# Altium schematic sheet MCU.SchDoc
size A4
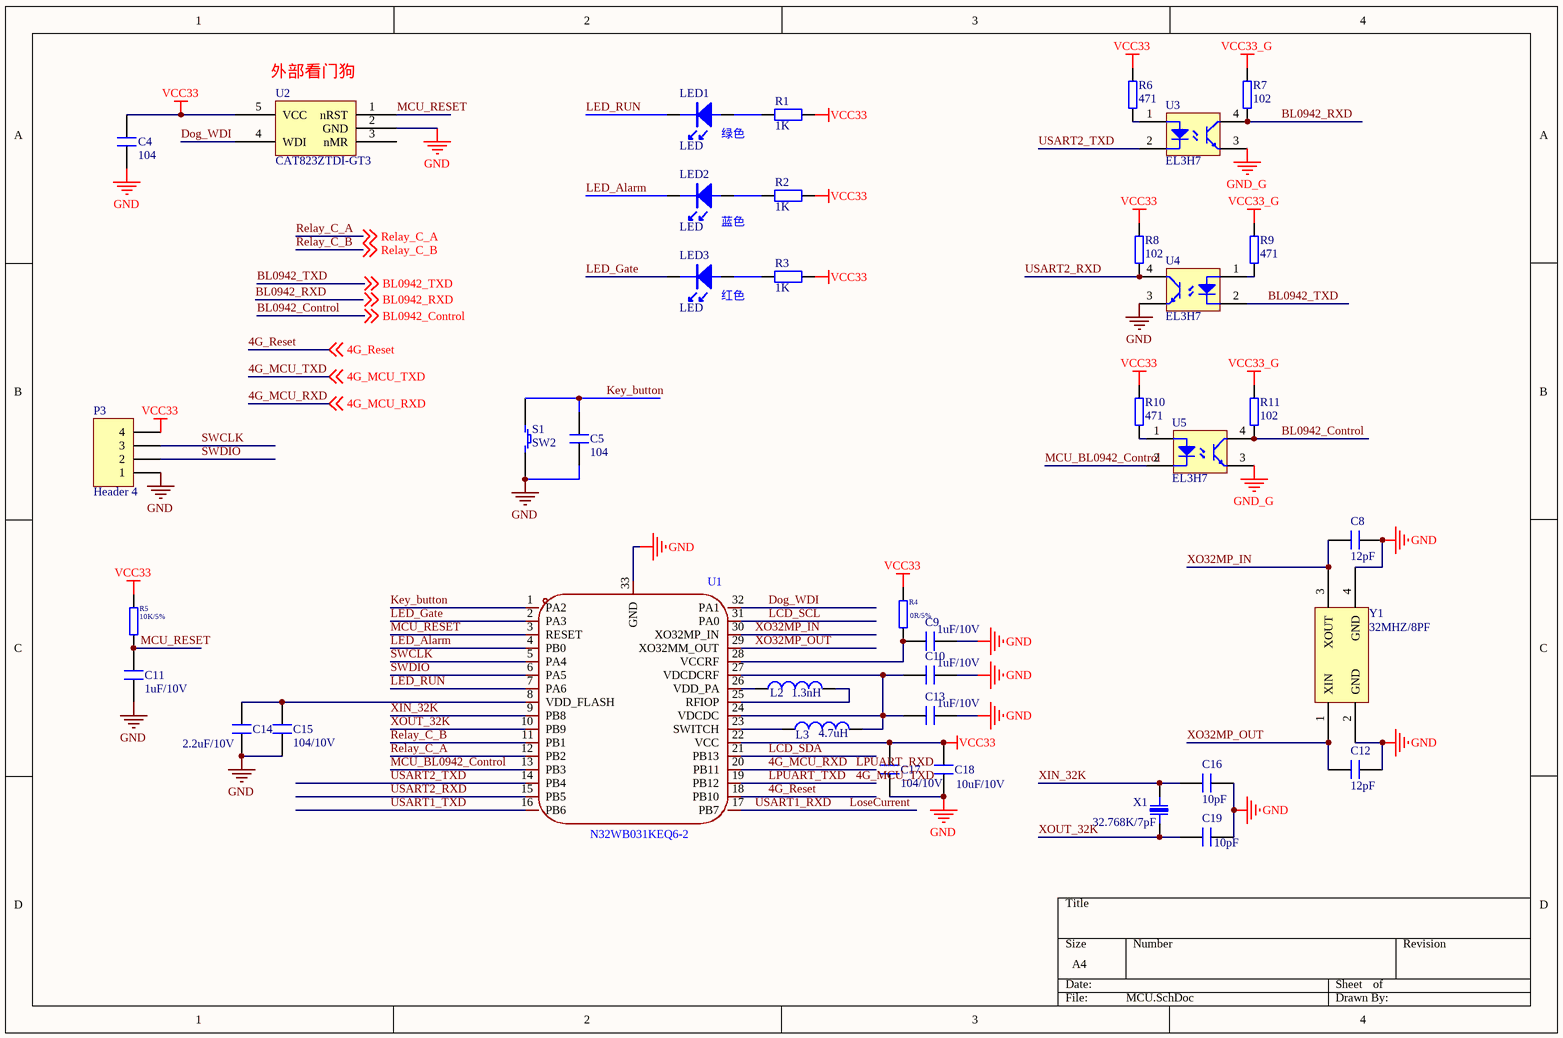
[diagram p0: MCU.SchDoc]

## Parts
C4  104  [0603R]
C5  104  [0603R]
C8  12pF  [0603r]
C9  1uF/10V  [0603R]
C10  1uF/10V  [0603R]
C11  1uF/10V  [0603R]
C12  12pF  [0603r]
C13  1uF/10V  [0603R]
C14  2.2uF/10V  [0603R]
C15  104/10V  [0603R]
C16  10pF  [0603r]
C17  104/10V  [0603R]
C18  10uF/10V  [0603R]
C19  10pF  [0603r]
L2  1.3nH  [0603R]
L3  4.7uH  [0603R]
LED1  LED  [LED0805]
LED2  LED  [LED0805]
LED3  LED  [LED0805]
P3  Header 4  [HDR1X4]
R1  value 1K  [0603R]  (hidden comment: Res2)
R2  value 1K  [0603R]  (hidden comment: Res2)
R3  value 1K  [0603R]  (hidden comment: Res2)
R4  0R/5%  [0603R]
R5  10K/5%  [0603R]
R6  471  [0603R]
R7  102  [0603R]
R8  102  [0603R]
R9  471  [0603R]
R10  471  [0603R]
R11  102  [0603R]
S1  SW2  [4.5*4.5贴片4脚独立按键]
U1  N32WB031KEQ6-2  [QFN-32_L4.0-W4.0-P0.40-TL-EP2.8]
U2  CAT823ZTDI-GT3  [SOT-23-5]
U3  EL3H7  [EL3H7]
U4  EL3H7  [EL3H7]
U5  EL3H7  [EL3H7]
X1  32.768K/7pF  [Y3215]
Y1  32MHZ/8PF  [3225]

## Nets
GND: C4.1 C5.2 C8.1 C9.1 C10.1 C11.1 C12.1 C13.1 C14.1 C15.1 C16.2 C17.1 C18.1 C19.1 P3.1 S1.2 U1.33(GND) U2.2(GND) U4.3(E) Y1.2(GND) Y1.4(GND)
GND_G: U3.3(E) U5.3(E)
VCC33: C4.2 C17.2 C18.2 P3.4 R1.1 R2.1 R3.1 R4.1 R5.1 R6.1 R8.2 R10.1 U1.22(VCC) U2.5(VCC)
VCC33_G: R7.2 R9.1 R11.2
4G_MCU_RXD: U1.20(PB11) ; off-sheet 4G_MCU_RXD  [also labelled LPUART_RXD]
4G_MCU_TXD: U1.19(PB12) ; off-sheet 4G_MCU_TXD  [also labelled LPUART_TXD]
4G_Reset: U1.18(PB10) ; off-sheet 4G_Reset
BL0942_Control: R11.1 U5.4(C) ; off-sheet BL0942_Control
BL0942_RXD: R7.1 U3.4(C) ; off-sheet BL0942_RXD
BL0942_TXD: U4.2(K) ; off-sheet BL0942_TXD
Dog_WDI: U1.32(PA1) U2.4(WDI)
Key_button: C5.1 S1.1 U1.1(PA2)
LCD_SCL: U1.31(PA0)
LCD_SDA: U1.21(PB13)
LED_Alarm: LED2.2 U1.4(PB0)
LED_Gate: LED3.2 U1.2(PA3)
LED_RUN: LED1.2 U1.7(PA6)
LoseCurrent: U1.17(PB7)  [also labelled USART1_RXD]
MCU_BL0942_Control: U1.13(PB3) U5.2(K)
MCU_RESET: C11.2 R5.2 U1.3(RESET) U2.1(nRST)
Relay_C_A: U1.12(PB2) ; off-sheet Relay_C_A
Relay_C_B: U1.11(PB1) ; off-sheet Relay_C_B
SWCLK: P3.3 U1.5(PA4)
SWDIO: P3.2 U1.6(PA5)
USART1_TXD: U1.16(PB6)
USART2_RXD: R8.1 U1.15(PB5) U4.4(C)
USART2_TXD: U1.14(PB4) U3.2(K)
XIN_32K: C16.1 U1.9(PB8) X1.2
XO32MP_IN: C8.2 U1.30(XO32MP_IN) Y1.3(XOUT)
XO32MP_OUT: C12.2 U1.29(XO32MM_OUT) Y1.1(XIN)
XOUT_32K: C19.2 U1.10(PB9) X1.1
NetC9_2: C9.2 R4.2 U1.28(VCCRF)
NetC10_2: C10.2 C13.2 L3.2 U1.24(VDCDC) U1.27(VDCDCRF)
NetC14_2: C14.2 C15.2 U1.8(VDD_FLASH)
NetL2_1: L2.1 U1.26(VDD_PA)
NetL2_2: L2.2 U1.25(RFIOP)
NetL3_1: L3.1 U1.23(SWITCH)
NetLED1_1: LED1.1 R1.2
NetLED2_1: LED2.1 R2.2
NetLED3_1: LED3.1 R3.2
NetR6_2: R6.2 U3.1(A)
NetR9_2: R9.2 U4.1(A)
NetR10_2: R10.2 U5.1(A)

Not connected (* = marked no-connect by the designer): U2 3(nMR)

## Notes on the sheet
- (near U2) 外部看门狗
- (near LED1) 绿色
- (near LED2) 蓝色
- (near LED3) 红色
- Labels drawn without touching a wire or pin: BL0942_RXD

## Library data of the parts
C4 C5 C8 C12 C16 C19 = CAP
C9-C11 C13-C15 C17 C18 = CAP_1
L2 L3 = Inductor: Code_IEC: 1005; Published: 8-Jun-2000; LatestRevisionDate: 29-May-2009; LatestRevisionNote: IPC-7351 Footprint Added.; PackageReference: 0402-A; Publisher: Altium Limited; PackageDescription: Chip Inductor; Code_JEITA: 0402
P3 = Header 4: Header, 4-Pin; LatestRevisionDate: 17-Jul-2002; LatestRevisionNote: Re-released for DXP Platform.; Publisher: Altium Limited
R4-R11 = RES
U1 = N32WB031KEQ6-2: Manufacturer: Nations(国民技术); Add into BOM: yes; Symbol: N32WB031KEQ6-2; Device: N32WB031KEQ6-2; LCSC Part Name: N32WB031KEQ6-2; Supplier Part: C2981446; Manufacturer Part: N32WB031KEQ6-2; Supplier Footprint: QFN-32; JLCPCB Part Class: Extended Part; Supplier: LCSC; Convert to PCB: yes
U2 = CAT823
U3-U5 = Optical_Coupler_1
X1 = XTAL
Y1 = 12MHz无源
R1-R3 = Res2: Published: 8-Jun-2000; LatestRevisionDate: 17-Jul-2002; LatestRevisionNote: Re-released for DXP Platform.; PackageReference: AXIAL-0.4; Publisher: Altium Limited; PackageDescription: Axial Device, Thru-Hole; 2 Leads; 0.4 in Pin Spacing